# EAGLE design SparkFun_Qwiic_Barometer_LPS28DFW (EAGLE 9.6.2)
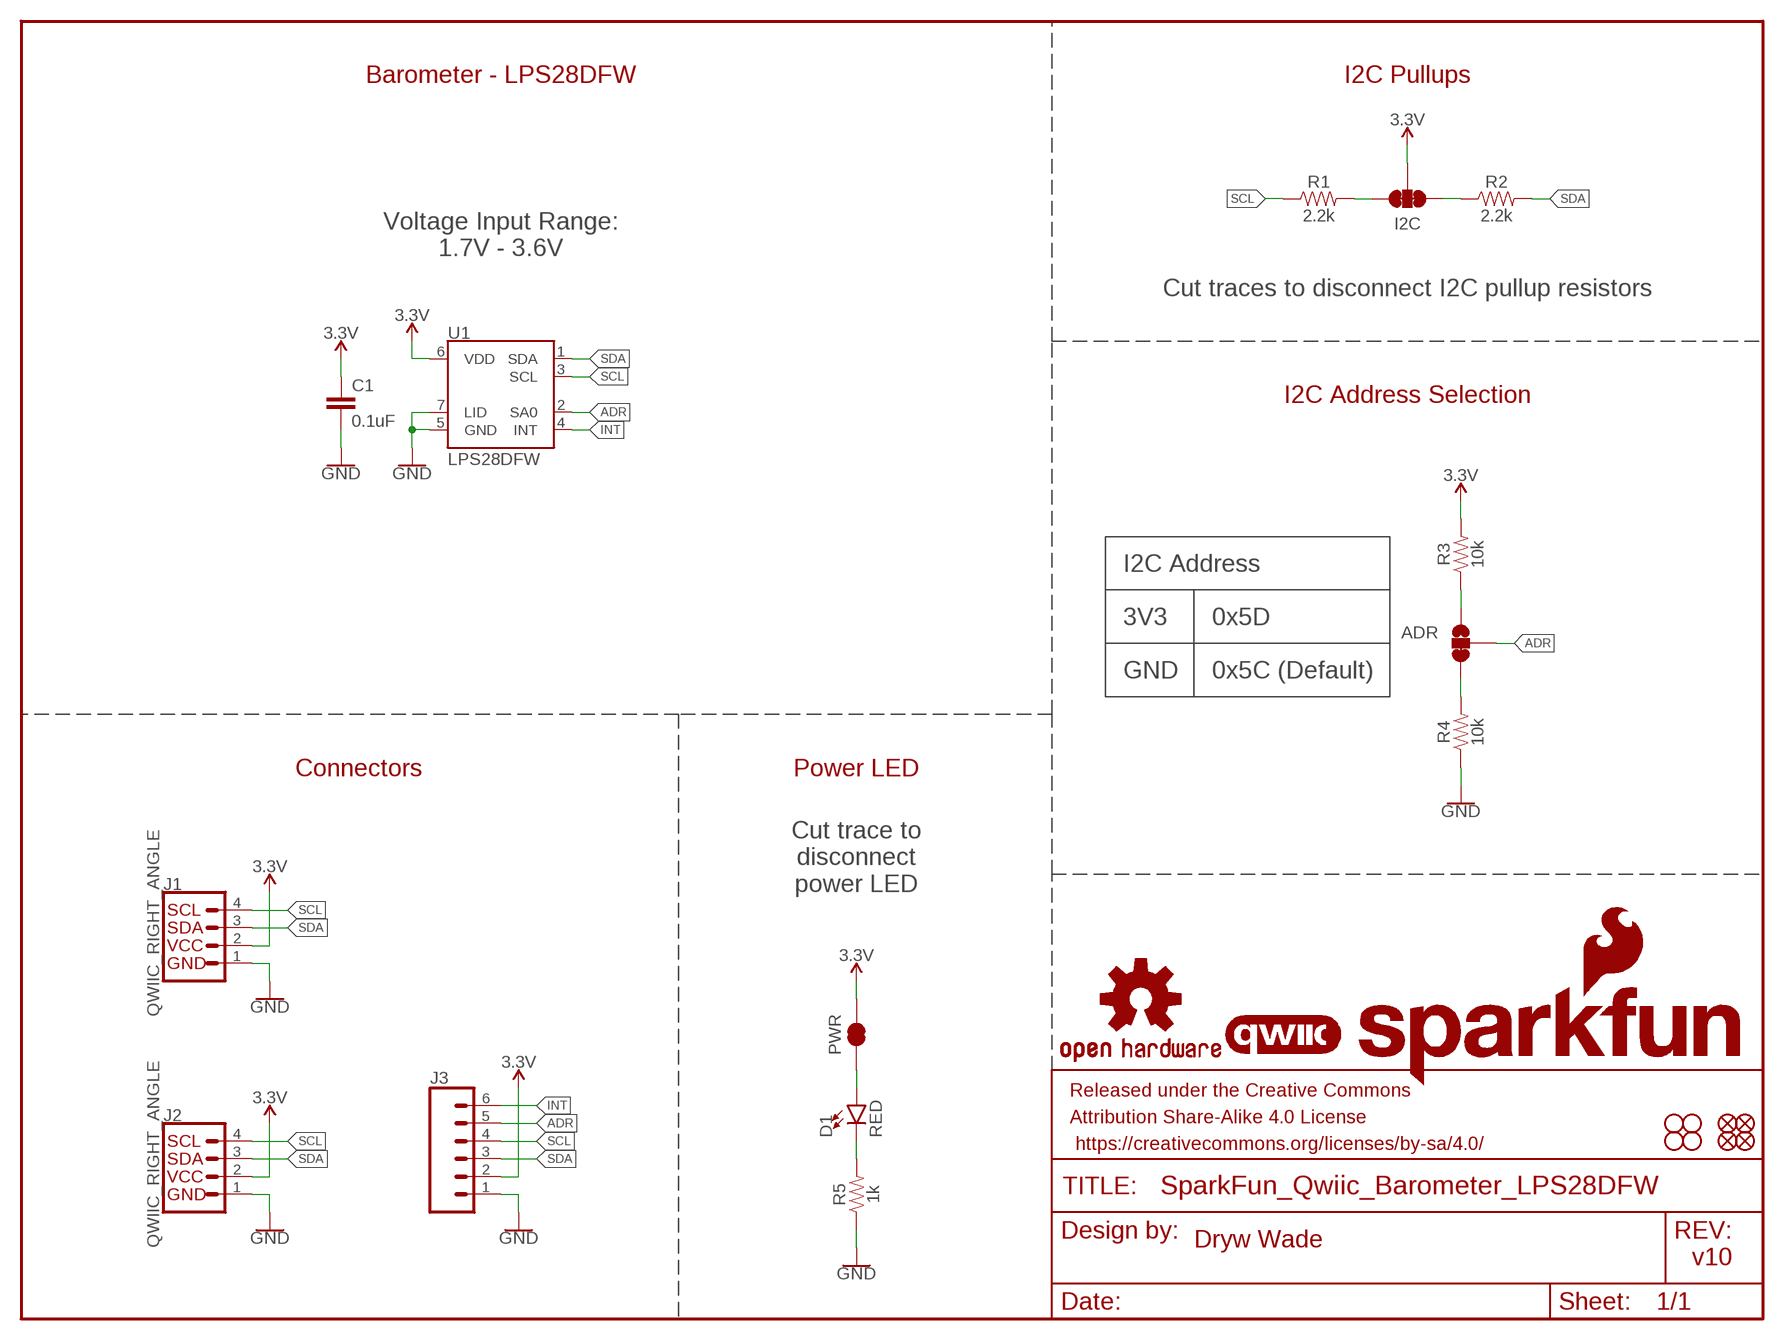
[diagram p0: schematic, sheet 1]

## Parts
ADR  JUMPER-SMT_3_1-NC_TRACE_SILK  [SMT-JUMPER_3_1-NC_TRACE_SILK]
C1  0.1uF  0.1UF-0603-25V-(+80/-20%)  [0603]
D1  RED  LED-RED0603  [LED-0603]
FD1  FIDUCIAL1X2  [FIDUCIAL-1X2]
FD2  FIDUCIAL1X2  [FIDUCIAL-1X2]
FD3  FIDUCIAL1X2  [FIDUCIAL-1X2]
FD4  FIDUCIAL1X2  [FIDUCIAL-1X2]
FRAME1  FRAME-LETTER  [CREATIVE_COMMONS]
H1  STAND-OFF  [STAND-OFF]
H2  STAND-OFF  [STAND-OFF]
H3  STAND-OFF  [STAND-OFF]
H4  STAND-OFF  [STAND-OFF]
I2C  JUMPER-SMT_3_2-NC_TRACE_SILK  [SMT-JUMPER_3_2-NC_TRACE_SILK]
J1  QWIIC_RIGHT_ANGLE  QWIIC_CONNECTORJS-1MM  [JST04_1MM_RA]
J2  QWIIC_RIGHT_ANGLE  QWIIC_CONNECTORJS-1MM  [JST04_1MM_RA]
J3  CONN_06NO_SILK_NO_POP  [1X06_NO_SILK]
LOGO1  OSHW-LOGOS  [OSHW-LOGO-S]
LOGO2  QWIIC_LOGO_5MM  [QWIIC_5MM]
LOGO3  SFE_LOGO_NAME_FLAME.1_INCH  [SFE_LOGO_NAME_FLAME_.1]
PWR  JUMPER-SMT_2_NC_TRACE_SILK  [SMT-JUMPER_2_NC_TRACE_SILK]
R1  2.2k  2.2KOHM-0603-1/10W-1%  [0603]
R2  2.2k  2.2KOHM-0603-1/10W-1%  [0603]
R3  10k  10KOHM-0603-1/10W-1%  [0603]
R4  10k  10KOHM-0603-1/10W-1%  [0603]
R5  1k  1KOHM-0603-1/10W-1%  [0603]
U1  LPS28DFW  [CCLGA-7L]

## Nets
3.3V: C1.1 I2C.2 J1.2 J2.2 J3.2 PWR.2 R3.2 U1.6(VDD)
ADR: ADR.2 J3.5 U1.2(SA0)
GND: C1.2 J1.1 J2.1 J3.1 R4.1 R5.1 U1.5(GND) U1.7(LID)
INT: J3.6 U1.4(INT)
N$1: D1.C R5.2
N$2: I2C.3 R1.2
N$3: I2C.1 R2.1
N$4: D1.A PWR.1
N$5: ADR.3 R4.2
N$6: ADR.1 R3.1
SCL: J1.4 J2.4 J3.4 R1.1 U1.3(SCL)
SDA: J1.3 J2.3 J3.3 R2.2 U1.1(SDA)

## Notes on the sheet
- Barometer - LPS28DFW | I2C Pullups
- Voltage Input Range:
  1.7V - 3.6V
- Cut traces to disconnect I2C pullup resistors
- I2C Address Selection
- I2C Address
- 3V3 | 0x5D
- GND | 0x5C (Default)
- Connectors | Power LED
- Cut trace to
  disconnect
  power LED
- Dryw Wade
- v10

## Library data of the parts
ADR = SparkFun-Jumpers:JUMPER-SMT_3_1-NC_TRACE: Normally closed trace jumper (1 of 2 connections) This jumper has a trace between two pads so it's normally closed (NC). The other connection is normally open (NO). Use a razor knife to open the connection. For best results follow the IPC guidelines for cutting traces: Cutout at least 0.063 mm (0.005 in). Remove all loose material to clean up the cut area. Seal the cut with an approved epoxy. Reapply solder to reclose the connection, or to close the NO connection.
C1 = SparkFun-Capacitors:0.1UF: 0.1µF ceramic capacitors A capacitor is a passive two-terminal electrical component used to store electrical energy temporarily in an electric field.; PROD_ID: CAP-00810
D1 = SparkFun-LED:LED-RED: Red SMD LED Used in manufacturing of most products at SparkFun Packages: 0603 - SMD 0603 package [Product Link] <http://docs.avagotech.com/docs/AV02-0551EN> 0603 SMART - SMD 0603 SMART package ( more efficient and expensive)[Product Link] <http://www.osram-os.com/Graphics/XPic2/00077099_0.pdf> 1206 - SMD1206 package [Product Link] <https://www.sparkfun.com/datasheets/DevTools/LilyPad/Q150OVS4.pdff> SparkFun Products: Pro Mini 328 -5V <https://www.sparkfun.com/products/821> RedBoard <https://www.sparkfun.com/products/12757> IOIO-OTG <https://www.sparkfun.com/products/13613>; PROD_ID: DIO-00819
FD1-FD4 = SparkFun-Aesthetics:FIDUCIAL: Fiducial Alignment Points Point-of-reference for pick-and-place machines and other optical instruments.
FRAME1 = SparkFun-Aesthetics:FRAME-LETTER: Schematic Frame - Letter Standard 8.5x11 US Letter frame
H1-H4 = SparkFun-Hardware:STAND-OFF: Stand Off Drill holes for mechanically mounting via screws, standoffs, etc. Note: Use the keepout ring to avoid running the screw head into surrounding components. Variant Overviews STAND-OFF - Mechanical footprint for a #4 phillips button head screw. STAND-OFF-TIGHT - Mechanical footprint for a #4 phillips button head screw, Example SparkFun Products Screw - Phillips Head (1/4", 4-40, 10 pack) <https://www.sparkfun.com/products/10453> (PRT-10453) Screw - Phillips Head (1/2", 4-40, 10 pack) <https://www.sparkfun.com/products/10452> (PRT-10452) Screw - Phillips Head (3/4", 4-40, 10 pack) <https://www.sparkfun.com/products/10451> (PRT-10451) Screw - Phillips Head (1", 4-40, 10 pack) <https://www.sparkfun.com/products/10450> (PRT-10450)
I2C = SparkFun-Jumpers:JUMPER-SMT_3_2-NC_TRACE: Normally closed trace jumper (2 of 2 connections) This jumper has a trace between all three pads so they are normally closed (NC). Use a razor knife to open the connection(s). For best results follow the IPC guidelines for cutting traces: Cutout at least 0.063 mm (0.005 in). Remove all loose material to clean up the cut area. Seal the cut with an approved epoxy. Reapply solder to reclose the connection(s).
J1 J2 = SparkFun-Connectors:QWIIC_CONNECTOR: SparkFun I2C Standard Qwiic Connector An SMD 1mm pitch JST connector makes it easy and quick (get it? Qwiic?) to connect I2C devices to each other. The Qwiic system <http://www.sparkfun.com/qwiic> enables fast and solderless connection between popular platforms and various sensors and actuators. We carry 200mm <https://www.sparkfun.com/products/14204>, 100mm <https://www.sparkfun.com/products/14205>, 50mm <https://www.sparkfun.com/products/14206>, and breadboard friendly <https://www.sparkfun.com/products/14207> Qwiic cables. We also offer 10 pcs strips <https://www.sparkfun.com/products/14323> the SMD connectors.; PROD_ID: CONN-13694
J3 = SparkFun-Connectors:CONN_06: Multi connection point. Often used as Generic Header-pin footprint for 0.1 inch spaced/style header connections On any of the 0.1 inch spaced packages, you can populate with these: Break Away Headers - Straight <https://www.sparkfun.com/products/116> (PRT-00116) Break Away Male Headers - Right Angle <https://www.sparkfun.com/products/553> (PRT-00553) Female Headers <https://www.sparkfun.com/products/115> (PRT-00115) Break Away Headers - Machine Pin <https://www.sparkfun.com/products/117> (PRT-00117) Break Away Female Headers - Swiss Machine Pin <https://www.sparkfun.com/products/743> (PRT-00743) Arduino Stackable Header - 6 Pin <https://www.sparkfun.com/products/9280> (PRT-09280) Screw Terminals 2.54mm Pitch (6-Pin) <https://www.sparkfun.com/products/16499> (PRT-16499) For SCREWTERMINALS and SPRING TERMINALS visit here: Screw Terimnals on SparkFun.com <https://www.sparkfun.com/search/results?term=Screw+Terminals> (5mm/3.5mm/2.54mm spacing) This device is also useful as a general connection point to wire up your design to another part of your project. Our various solder wires solder well into these plated through hole pads. Hook-Up Wire - Assortment (Stranded, 22 AWG) <https://www.sparkfun.com/products/11375> (PRT-11375) Hook-Up Wire - Assortment (Solid Core, 22 AWG) <https://www.sparkfun.com/products/11367> (PRT-11367) View the entire wire category on our website here <https://www.sparkfun.com/categories/141>
LOGO1 = SparkFun-Aesthetics:OSHW-LOGO: Open-Source Hardware (OSHW) Logo This logo indicates the piece of hardware it is found on incorporates a OSHW license and/or adheres to the definition of open source hardware found here: http://freedomdefined.org/OSHW
LOGO2 = SparkFun-Aesthetics:QWIIC_LOGO: Qwiic Logos for placement on schematic and PCB. The 5.5mm silk logo is best for placing next to Qwiic connector.
LOGO3 = SparkFun-Aesthetics:SFE_LOGO_NAME_FLAME: SparkFun Font Logo w/ Flame This is the SparkFun full logo. The logo on the schematic will always be the same size; the package variant is the height of the flame part of the logo. Default layer for the logo on the board is tSilk.
PWR = SparkFun-Jumpers:JUMPER-SMT_2_NC_TRACE: Normally closed trace jumper This jumper has a trace between two pads so it's normally closed (NC). Use a razor knife to open the connection. For best results follow the IPC guidelines for cutting traces: Cutout at least 0.063 mm (0.005 in). Remove all loose material to clean up the cut area. Seal the cut with an approved epoxy. Reapply solder to reclose the connection.
R1 R2 = SparkFun-Resistors:2.2KOHM: 2.2kΩ resistor A resistor is a passive two-terminal electrical component that implements electrical resistance as a circuit element. Resistors act to reduce current flow, and, at the same time, act to lower voltage levels within circuits. - Wikipedia; PROD_ID: RES-08272
R3 R4 = SparkFun-Resistors:10KOHM: 10kΩ resistor A resistor is a passive two-terminal electrical component that implements electrical resistance as a circuit element. Resistors act to reduce current flow, and, at the same time, act to lower voltage levels within circuits. - Wikipedia; PROD_ID: RES-00824
R5 = SparkFun-Resistors:1KOHM: 1kΩ resistor A resistor is a passive two-terminal electrical component that implements electrical resistance as a circuit element. Resistors act to reduce current flow, and, at the same time, act to lower voltage levels within circuits. - Wikipedia; PROD_ID: RES-07856
U1 = SparkFun-Sensors:LPS28DFW; PROD_ID: IC-17197

## Board
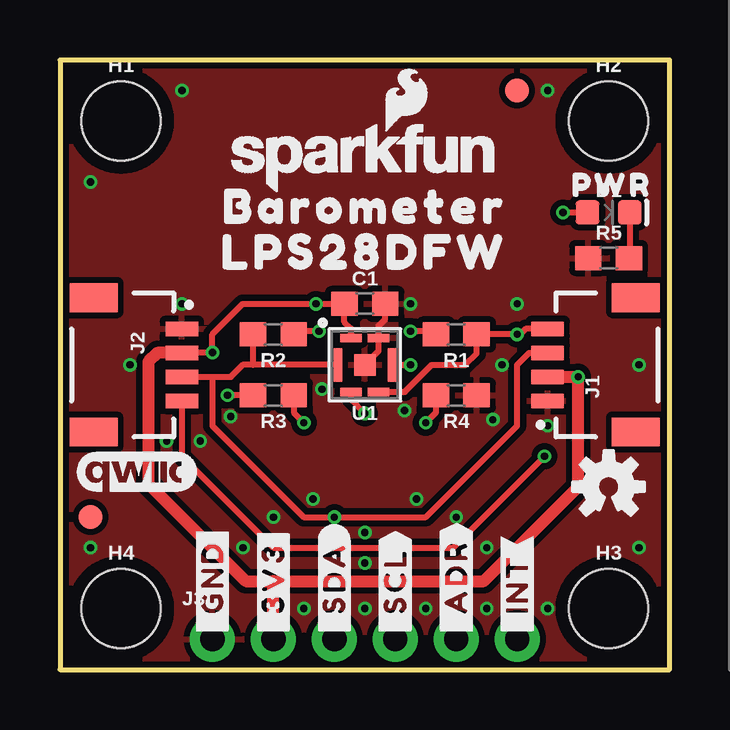
[diagram p1: board, top side]
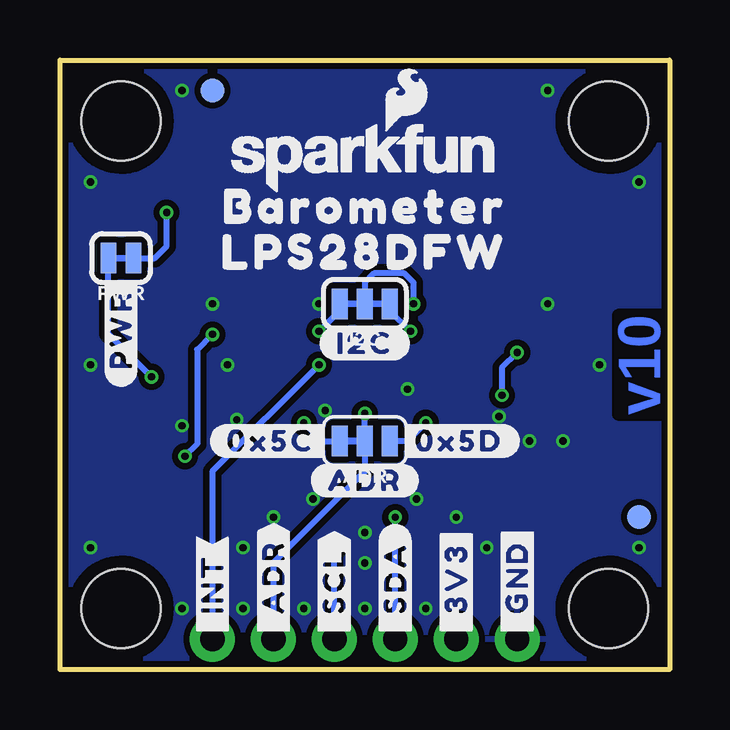
[diagram p2: board, bottom side, seen from below]

Size 25.4 x 25.4 mm. Coordinates in mm from the lower left corner, seen from the top.
Outline: 0,0 25.4,0 25.4,25.4 0,25.4 0,0
Copper layers (1*16): Top 0.035mm / dielectric 1.5mm / Bottom 0.035mm
Design rules "SparkFun-2-Layer-Minimum-JLCPCB": minimum track width 5mil, minimum drill 0.3mm, track to track 5mil, track to pad 5mil, pad to pad 5mil, via to via 5mil, smd to smd 5mil, copper to edge 7mil, drill to drill 7mil, minimum pad ring 5mil, minimum via ring 5mil, stop-mask expansion 2.5mil, vias tented up to drill 25mil, thermal gap 10mil

### Footprints (pad centres in the part's own frame; a part is rotated, then mirrored left to right if it is on the bottom)
SMT-JUMPER_3_1-NC_TRACE_SILK = smd 0.66 x 1.27: 1 -1.041,0; 2 0,0; 3 1.041,0
0603 = smd 1.1 x 1: 1 -0.85,0; 2 0.85,0
LED-0603 = smd 1 x 1: A -0.877,0; C 0.877,0
FIDUCIAL-1X2 = smd 1 x 1: 1 0,0
STAND-OFF = hole 3.302: 0,0
SMT-JUMPER_3_2-NC_TRACE_SILK = smd 0.66 x 1.27: 1 -1.041,0; 2 0,0; 3 1.041,0
JST04_1MM_RA = smd 0.6 x 1.35: 1 -1.5,0; 2 -0.5,0; 3 0.5,0; 4 1.5,0 | smd 1.2 x 2: NC1 2.8,-3.675; NC2 -2.8,-3.675
1X06_NO_SILK = drill 1.016 pad 1.88: 1 0,0; 2 2.54,0; 3 5.08,0; 4 7.62,0; 5 10.16,0; 6 12.7,0
SMT-JUMPER_2_NC_TRACE_SILK = smd 0.66 x 1.27: 1 -0.521,0; 2 0.521,0
CCLGA-7L = smd 0.35 x 1.4: 1 1.125,0; 4 -1.125,0 | smd 0.9 x 0.35: 2 0.575,1.125; 3 -0.575,1.125; 5 -0.575,-1.125; 6 0.575,-1.125 | smd 0.9 x 0.9: 7 0,0

### Placement (x,y rotation side)
ADR  12.7,9.53 180 bottom
C1  12.7,15.24 0 top
D1  22.86,19.05 0 top
FD1  1.27,6.35 0 bottom
FD2  1.27,6.35 0 top
FD3  19.05,24.13 0 bottom
FD4  19.05,24.13 0 top
FRAME1  -10.16,-29.21 0 top  (outside the outline)
H1  2.54,22.86 0 top
H2  22.86,22.86 0 top
H3  22.86,2.54 0 top
H4  2.54,2.54 0 top
I2C  12.7,15.24 180 bottom
J1  20.32,12.7 90 top
J2  5.08,12.7 270 top
J3  6.35,1.27 0 top
LOGO1  22.86,7.62 0 top
LOGO2  3.17,8.26 0 top
LOGO3  12.7,21.34 0 top
LOGO4  SFE_LOGO_NAME_FLAME.1_INCH  [SFE_LOGO_NAME_FLAME_.1]  12.7,21.34 0 bottom
PWR  22.86,17.14 180 bottom
R1  16.51,13.97 180 top
R2  8.89,13.97 180 top
R3  8.89,11.43 180 top
R4  16.51,11.43 180 top
R5  22.86,17.14 0 top
U1  12.7,12.7 180 top
U$1  [#_GND#0]  6.35,1.27 90 top
U$2  [#_GND#0]  6.35,1.27 90 bottom
U$3  [#_3V3#0]  8.89,1.27 90 top
U$4  [#_3V3#0]  8.89,1.27 90 bottom
U$5  [#_SDA#0]  11.43,1.27 90 top
U$6  [#_SDA#0]  11.43,1.27 90 bottom
U$7  [#_SCL#0]  13.97,1.27 90 top
U$8  [#_SCL#0]  13.97,1.27 90 bottom
U$9  [#I2C#0]  12.7,13.59 0 bottom
U$10  [#ADR#0]  12.7,7.87 0 bottom
U$11  [BAROMETER0]  12.7,19.3 0 top
U$12  [LPS28DFW0]  12.7,17.4 0 top
U$13  [#PWR#0]  22.86,16.51 90 bottom
U$14  [BAROMETER0]  12.7,19.3 0 bottom
U$15  [LPS28DFW0]  12.7,17.4 0 bottom
U$16  [#0X5D#0]  11.3,9.53 0 bottom
U$17  [#0X5C#0]  14.1,9.53 0 bottom
U$18  [PWR0]  22.99,20.19 0 top
U$19  [ORDERING_INSTRUCTIONS]  27.94,50.8 0 top  (outside the outline)
U$20  [#_INT#0]  19.05,1.27 90 top
U$21  [#_INT#0]  19.05,1.27 90 bottom
U$22  [#_ADR#0]  16.51,1.27 90 top
U$23  [#_ADR#0]  16.51,1.27 90 bottom

### Tracks (layer width: path | path; a pad name or v marks a point on that pad's centre or on a via)
3.3V  (via drill 0.3)
  Top 0.254: U1.6 12.12,14.21 11.85,14.48 C1.1 v10.67,15.24 7.62,15.24 6.35,13.97 v6.35,13.21 J2.2 | R3.2 v6.99,11.43
  Top 0.508: J2.2 4.06,13.2 3.68,12.82 3.68,7.75 7.75,3.68 8.89,3.68 | J1.2 v21.59,12.2 21.59,7.62 17.65,3.68 8.89,3.68 | J3.2 8.89,3.68
  Bottom 0.254: v6.35,13.21 6.99,12.57 v6.99,11.43 | v21.59,12.2 23.38,13.99 PWR.2 | v10.67,15.24 10.67,16.13 11.05,16.51 12.32,16.51 12.7,16.13 I2C.2
ADR  (via drill 0.3)
  Top 0.254: v12.7,10.67 12.12,11.24 U1.2
  Bottom 0.254: J3.5 16.51,4.45 12.7,8.26 ADR.2 v12.7,10.67
GND  (via drill 0.3)
  Top 0.254: U1.7 13.28,13.28 U1.5 13.28,14.33 13.55,14.61 C1.2
  other vias: 24.13,5.08 17.78,2.54 15.24,2.54 12.7,2.54 10.16,2.54 20.32,2.54 1.27,5.08 24.13,12.7 24.13,20.32 20.32,24.13 5.08,24.13 1.27,20.32 2.92,12.7 18.41,12.7 18.03,10.41 14.35,10.79 10.92,11.68 7.11,10.54 10.54,7.11 14.86,7.11 5.84,9.53 20.32,10.16 5.08,15.24 16.51,6.35 8.89,6.35 7.62,5.08 17.78,5.08 12.7,4.45 12.7,5.71 4.45,9.53 19.05,15.24 14.61,15.24
  pour Top (isolate 0.254): 0,0 25.4,0 25.4,25.4 0,25.4
  pour Bottom (isolate 0.254): 0,0 25.4,0 25.4,25.4 0,25.4
INT  (via drill 0.3)
  Top 0.254: U1.4 v14.61,12.7
  Bottom 0.254: v14.61,12.7 19.05,8.26 J3.6
N$1
  Top 0.254: D1.C 23.74,17.17 R5.2
N$2  (via drill 0.3)
  Top 0.254: R1.2 15.53,14.1 v14.61,14.1
  Bottom 0.254: v14.61,14.1 13.74,14.96 I2C.3
N$3  (via drill 0.3)
  Top 0.254: v10.79,14.1 9.87,14.1 R2.1
  Bottom 0.254: I2C.1 11.66,14.96 v10.79,14.1
N$4  (via drill 0.3)
  Top 0.254: v20.95,19.05 D1.A
  Bottom 0.254: PWR.1 21.45,17.14 20.95,17.64 v20.95,19.05
N$5  (via drill 0.3)
  Top 0.254: R4.2 15.66,10.71 v15.24,10.29
  Bottom 0.254: v15.24,10.29 14.48,9.53 ADR.3
N$6  (via drill 0.3)
  Top 0.254: R3.1 9.74,10.71 v10.16,10.29
  Bottom 0.254: v10.16,10.29 10.92,9.53 ADR.1
SCL  (via drill 0.3)
  Top 0.254: J2.4 5.08,8.89 8.89,5.08 v13.97,5.08 16.38,5.08 v20.19,8.89 | J1.4 19.41,14.2 19.18,13.97 v19.05,13.97 R1.1 17.36,13.17 16.89,12.7 15.49,12.7 14.37,11.57 U1.3
  Bottom 0.254: v20.19,8.89 19.68,9.4 19.68,13.34 v19.05,13.97 | J3.4 v13.97,5.08
SDA  (via drill 0.3)
  Top 0.254: J2.3 6.35,12.2 | 6.35,12.2 6.35,10.16 10.16,6.35 v11.43,6.35 15.24,6.35 19.05,10.16 19.05,12.7 19.55,13.2 J1.3 | 6.35,12.2 7.12,12.2 7.62,12.7 8.04,12.7 | R2.2 8.04,12.7 | U1.1 8.04,12.7
  Bottom 0.254: J3.3 v11.43,6.35

### Text on the board
Bottom: v10
Measures: Units: inches
tDocu: 2-Layer | 1.6mm Thickness | Lead-Free HASL | Dryw Wade